# Altium schematic sheet 2018-02-11_13-18-481.schdoc
size 351 x 172 mm; SheetNumber: 1; SheetTotal: 1
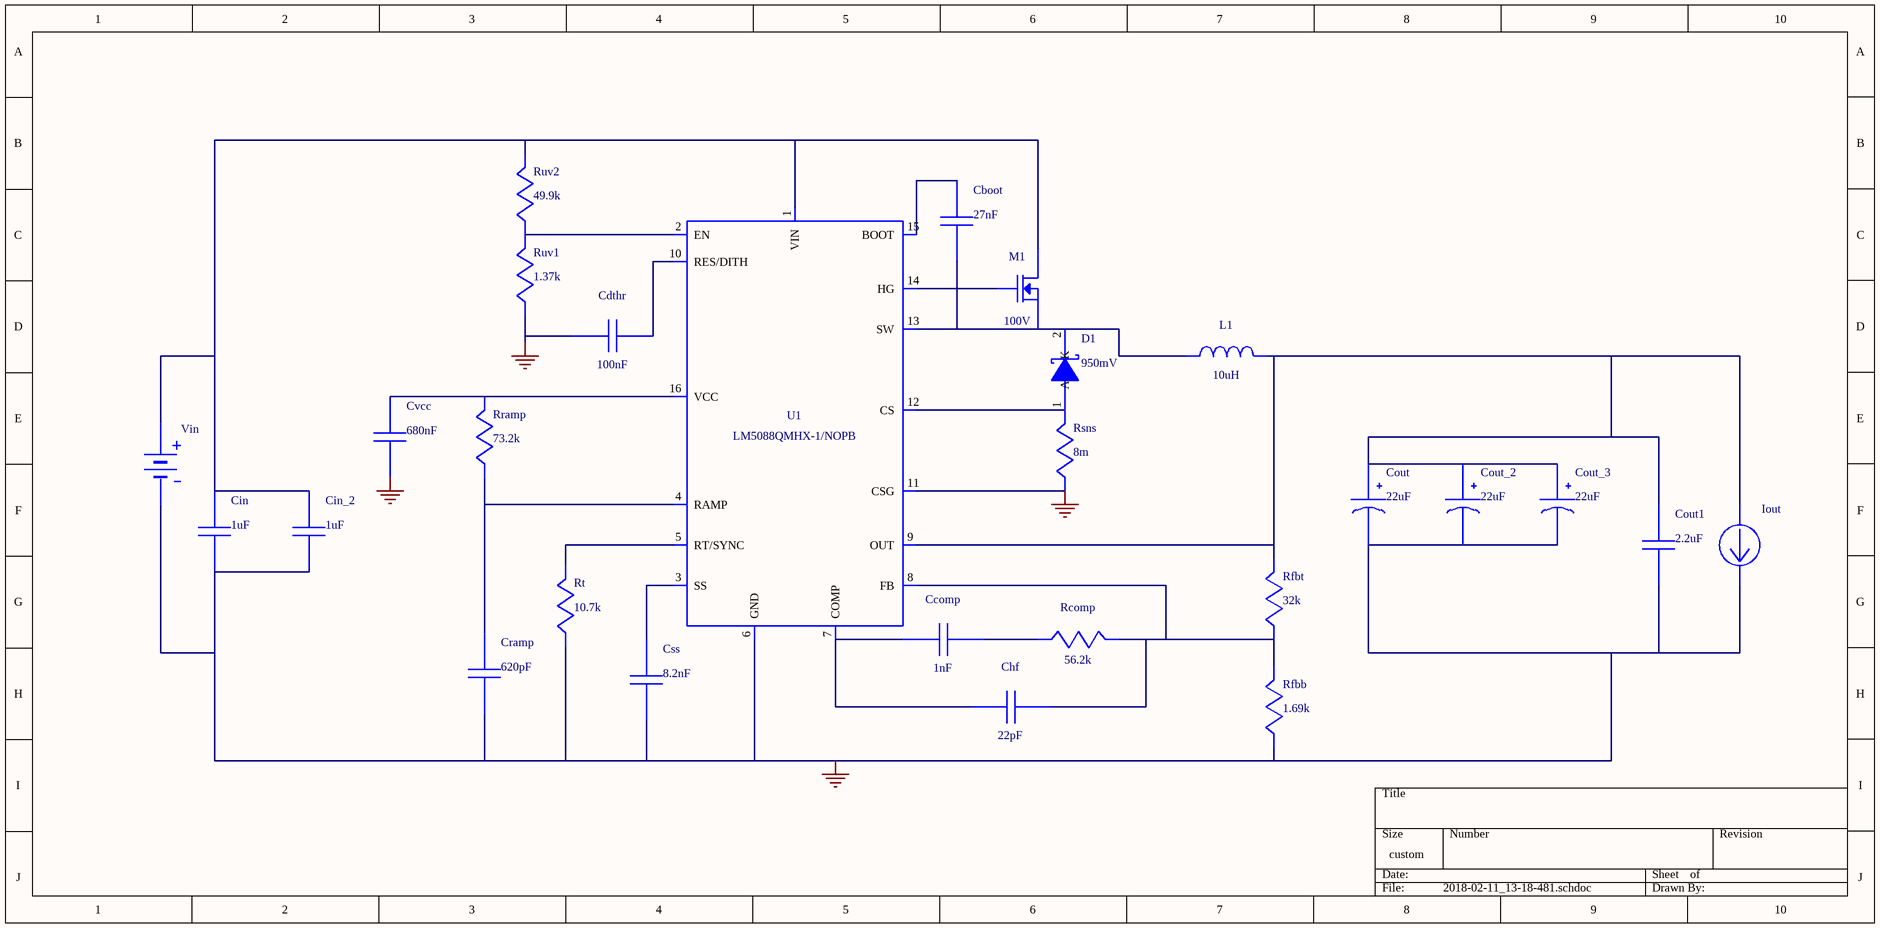
[diagram p0: 2018-02-11_13-18-481.schdoc]

## Parts
Cboot  value 27nF  (hidden comment: C1812C273J5GACTU)
Ccomp  value 1nF  (hidden comment: C0805C102K5GACTU)
Cdthr  value 100nF  (hidden comment: 08053C104JAZ2A)
Chf  value 22pF  (hidden comment: C0805C220K3GACTU)
Cin  value 1uF  (hidden comment: C3216X7R2A105K160AA)
Cin_2  value 1uF  (hidden comment: C3216X7R2A105K160AA)
Cout  value 22uF  (hidden comment: 35SVPF22M)
Cout1  value 2.2uF  (hidden comment: C2012X7R1H225K125AC)
Cout_2  value 22uF  (hidden comment: 35SVPF22M)
Cout_3  value 22uF  (hidden comment: 35SVPF22M)
Cramp  value 620pF  (hidden comment: CL21C621JBCNNNC)
Css  value 8.2nF  (hidden comment: CL21C822JBFNNNE)
Cvcc  value 680nF  (hidden comment: ECPU1C684MA5)
D1  value 950mV  (hidden comment: SBRD10200TR)
Iout  WB_CURRENT_LOAD  (value not drawn)
L1  value 10uH  (hidden comment: SER2915L-103KL)
M1  value 100V  (hidden comment: CSD19534Q5A)
Rcomp  value 56.2k  (hidden comment: ERJ-6ENF5622V)
Rfbb  value 1.69k  (hidden comment: ERJ-6ENF1691V)
Rfbt  value 32k  (hidden comment: RT0805BRD0732KL)
Rramp  value 73.2k  (hidden comment: ERJ-6ENF7322V)
Rsns  value 8m  (hidden comment: PRL1632-R008-F-T1)
Rt  value 10.7k  (hidden comment: ERJ-6ENF1072V)
Ruv1  value 1.37k  (hidden comment: CRCW08051K37FKEA)
Ruv2  value 49.9k  (hidden comment: ERJ-6ENF4992V)
U1  PackageReference: LM5088QMHX-1/NOPB  (hidden comment: LM5088MHX-2/NOPB)
Vin  WB_BATTERY  (value not drawn)

## Nets
0: Cdthr.1 Cin.2 Cin_2.2 Cout.2(-) Cout1.2 Cout_2.2(-) Cout_3.2(-) Cramp.2 Css.2 Cvcc.2 Iout.2(-) Rfbb.2 Rsns.2 Rt.2 Ruv1.2 U1.6(GND) U1.11(CSG) U1.17(EP) Vin.2(-)
NetCboot_1: Cboot.1 D1.2(K) L1.1 M1.1(Source) M1.2(Source) M1.3(Source) U1.13(SW)
NetCboot_2: Cboot.2 U1.15(BOOT)
NetCcomp_1: Ccomp.1 Rcomp.2
NetCcomp_2: Ccomp.2 Chf.1 U1.7(COMP)
NetCdthr_2: Cdthr.2 U1.10(RES/DITH)
NetChf_2: Chf.2 Rcomp.1 Rfbb.1 Rfbt.2 U1.8(FB)
NetCin_1: Cin.1 Cin_2.1 M1.5(Drain) M1.6(Drain) M1.7(Drain) M1.8(Drain) M1.9(Drain) Ruv2.1 U1.1(VIN) Vin.1(+)
NetCout_1: Cout.1(+) Cout1.1 Cout_2.1(+) Cout_3.1(+) Iout.1(+) L1.2 Rfbt.1 U1.9(OUT)
NetCramp_1: Cramp.1 Rramp.2 U1.4(RAMP)
NetCss_1: Css.1 U1.3(SS)
NetCvcc_1: Cvcc.1 Rramp.1 U1.16(VCC)
NetD1_1: D1.1(A) D1.3(A) Rsns.1 U1.12(CS)
NetM1_4: M1.4(Gate) U1.14(HG)
NetRt_1: Rt.1 U1.5(RT/SYNC)
NetRuv1_1: Ruv1.1 Ruv2.2 U1.2(EN)

## Library data of the parts
Cboot = C1812C273J5GACTU: Manufacturer Name: Kemet; PackageReference: C1812C273J5GACTU; Manufacturer Part Number: C1812C273J5GACTU
Ccomp = C0805C102K5GACTU: Manufacturer Name: Kemet; PackageReference: C0805C102K5GACTU; Manufacturer Part Number: C0805C102K5GACTU
Cdthr = 08053C104JAZ2A: Manufacturer Name: AVX; PackageReference: 08053C104JAZ2A; Manufacturer Part Number: 08053C104JAZ2A
Chf = C0805C220K3GACTU: Manufacturer Name: Kemet; PackageReference: C0805C220K3GACTU; Manufacturer Part Number: C0805C220K3GACTU
Cin Cin_2 = C3216X7R2A105K160AA: C3216X7R2A105K16; Manufacturer Name: TDK; PackageReference: C3216X7R2A105K160AA; Manufacturer Part Number: C3216X7R2A105K160AA
Cout Cout_2 Cout_3 = 35SVPF22M: Manufacturer Name: Panasonic; PackageReference: 35SVPF22M; Manufacturer Part Number: 35SVPF22M
Cout1 = C2012X7R1H225K125AC: C2012X7R1H225K12; Manufacturer Name: TDK; PackageReference: C2012X7R1H225K125AC; Manufacturer Part Number: C2012X7R1H225K125AC
Cramp = CL21C621JBCNNNC: Manufacturer Name: Samsung Electro-Mechanics; PackageReference: CL21C621JBCNNNC; Manufacturer Part Number: CL21C621JBCNNNC
Css = CL21C822JBFNNNE: Manufacturer Name: Samsung Electro-Mechanics; PackageReference: CL21C822JBFNNNE; Manufacturer Part Number: CL21C822JBFNNNE
Cvcc = ECPU1C684MA5: Manufacturer Name: Panasonic; PackageReference: ECPU1C684MA5; Manufacturer Part Number: ECPU1C684MA5
D1 = SBRD10200TR: Manufacturer Name: SMC Diode Solutions; PackageReference: SBRD10200TR; Manufacturer Part Number: SBRD10200TR
L1 = SER2915L-103KL: Manufacturer Name: Coilcraft; PackageReference: SER2915L-103KL; Manufacturer Part Number: SER2915L-103KL
M1 = CSD19534Q5A: Manufacturer Name: Texas Instruments; PackageReference: CSD19534Q5A; Manufacturer Part Number: CSD19534Q5A
Rcomp = ERJ-6ENF5622V: Manufacturer Name: Panasonic; PackageReference: ERJ-6ENF5622V; Manufacturer Part Number: ERJ-6ENF5622V
Rfbb = ERJ-6ENF1691V: Manufacturer Name: Panasonic; PackageReference: ERJ-6ENF1691V; Manufacturer Part Number: ERJ-6ENF1691V
Rfbt = RT0805BRD0732KL: Manufacturer Name: Yageo America; PackageReference: RT0805BRD0732KL; Manufacturer Part Number: RT0805BRD0732KL
Rramp = ERJ-6ENF7322V: Manufacturer Name: Panasonic; PackageReference: ERJ-6ENF7322V; Manufacturer Part Number: ERJ-6ENF7322V
Rsns = PRL1632-R008-F-T1: PRL1632-R008-F-T; Manufacturer Name: Susumu Co Ltd; PackageReference: PRL1632-R008-F-T1; Manufacturer Part Number: PRL1632-R008-F-T1
Rt = ERJ-6ENF1072V: Manufacturer Name: Panasonic; PackageReference: ERJ-6ENF1072V; Manufacturer Part Number: ERJ-6ENF1072V
Ruv1 = CRCW08051K37FKEA: Manufacturer Name: Vishay-Dale; PackageReference: CRCW08051K37FKEA; Manufacturer Part Number: CRCW08051K37FKEA
Ruv2 = ERJ-6ENF4992V: Manufacturer Name: Panasonic; PackageReference: ERJ-6ENF4992V; Manufacturer Part Number: ERJ-6ENF4992V
U1 = LM5088MHX-2/NOPB: LM5088QMHX-1/NOP; Manufacturer Name: Texas Instruments; Manufacturer Part Number: LM5088MHX-2/NOPB; Value: N/A
Iout = WB_CURRENT_LOAD: PackageReference: WB_CURRENT_LOAD; Manufacturer Part Number: WB_CURRENT_LOAD; Manufacturer Name: WB_CURRENT_LOAD; Value: N/A
Vin = WB_BATTERY: PackageReference: WB_BATTERY; Manufacturer Part Number: WB_BATTERY; Manufacturer Name: WB_BATTERY; Value: N/A